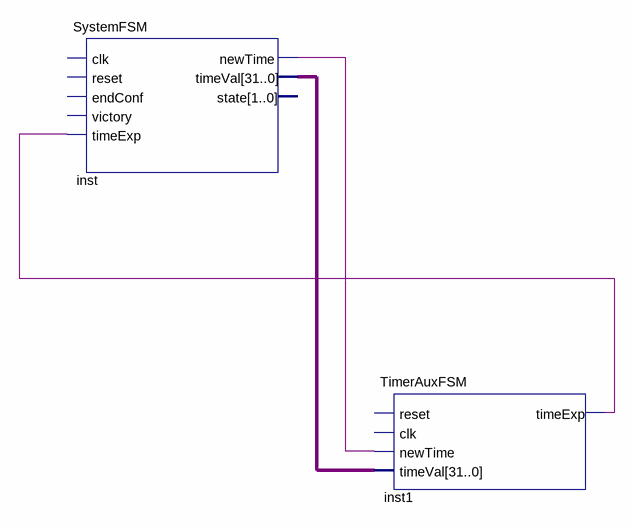
[diagram p0: schematic sheet]
// Quartus schematic top_level_schematic.bdf as structural Verilog: 2 symbols, 0 pins
module top_level_schematic (
);

  wire inst1_timeexp, inst_newtime;
  wire [31:0] inst_timeval;

  SystemFSM inst (
    .timeExp(inst1_timeexp), .newTime(inst_newtime), .timeVal(inst_timeval));  // open: clk, reset, endConf, victory, state
  TimerAuxFSM inst1 (.newTime(inst_newtime), .timeVal(inst_timeval), .timeExp(inst1_timeexp));  // open: reset, clk
endmodule
